# EAGLE schematic 8-STEP-SEQUENCER-1-1 (EAGLE 8.6.0)
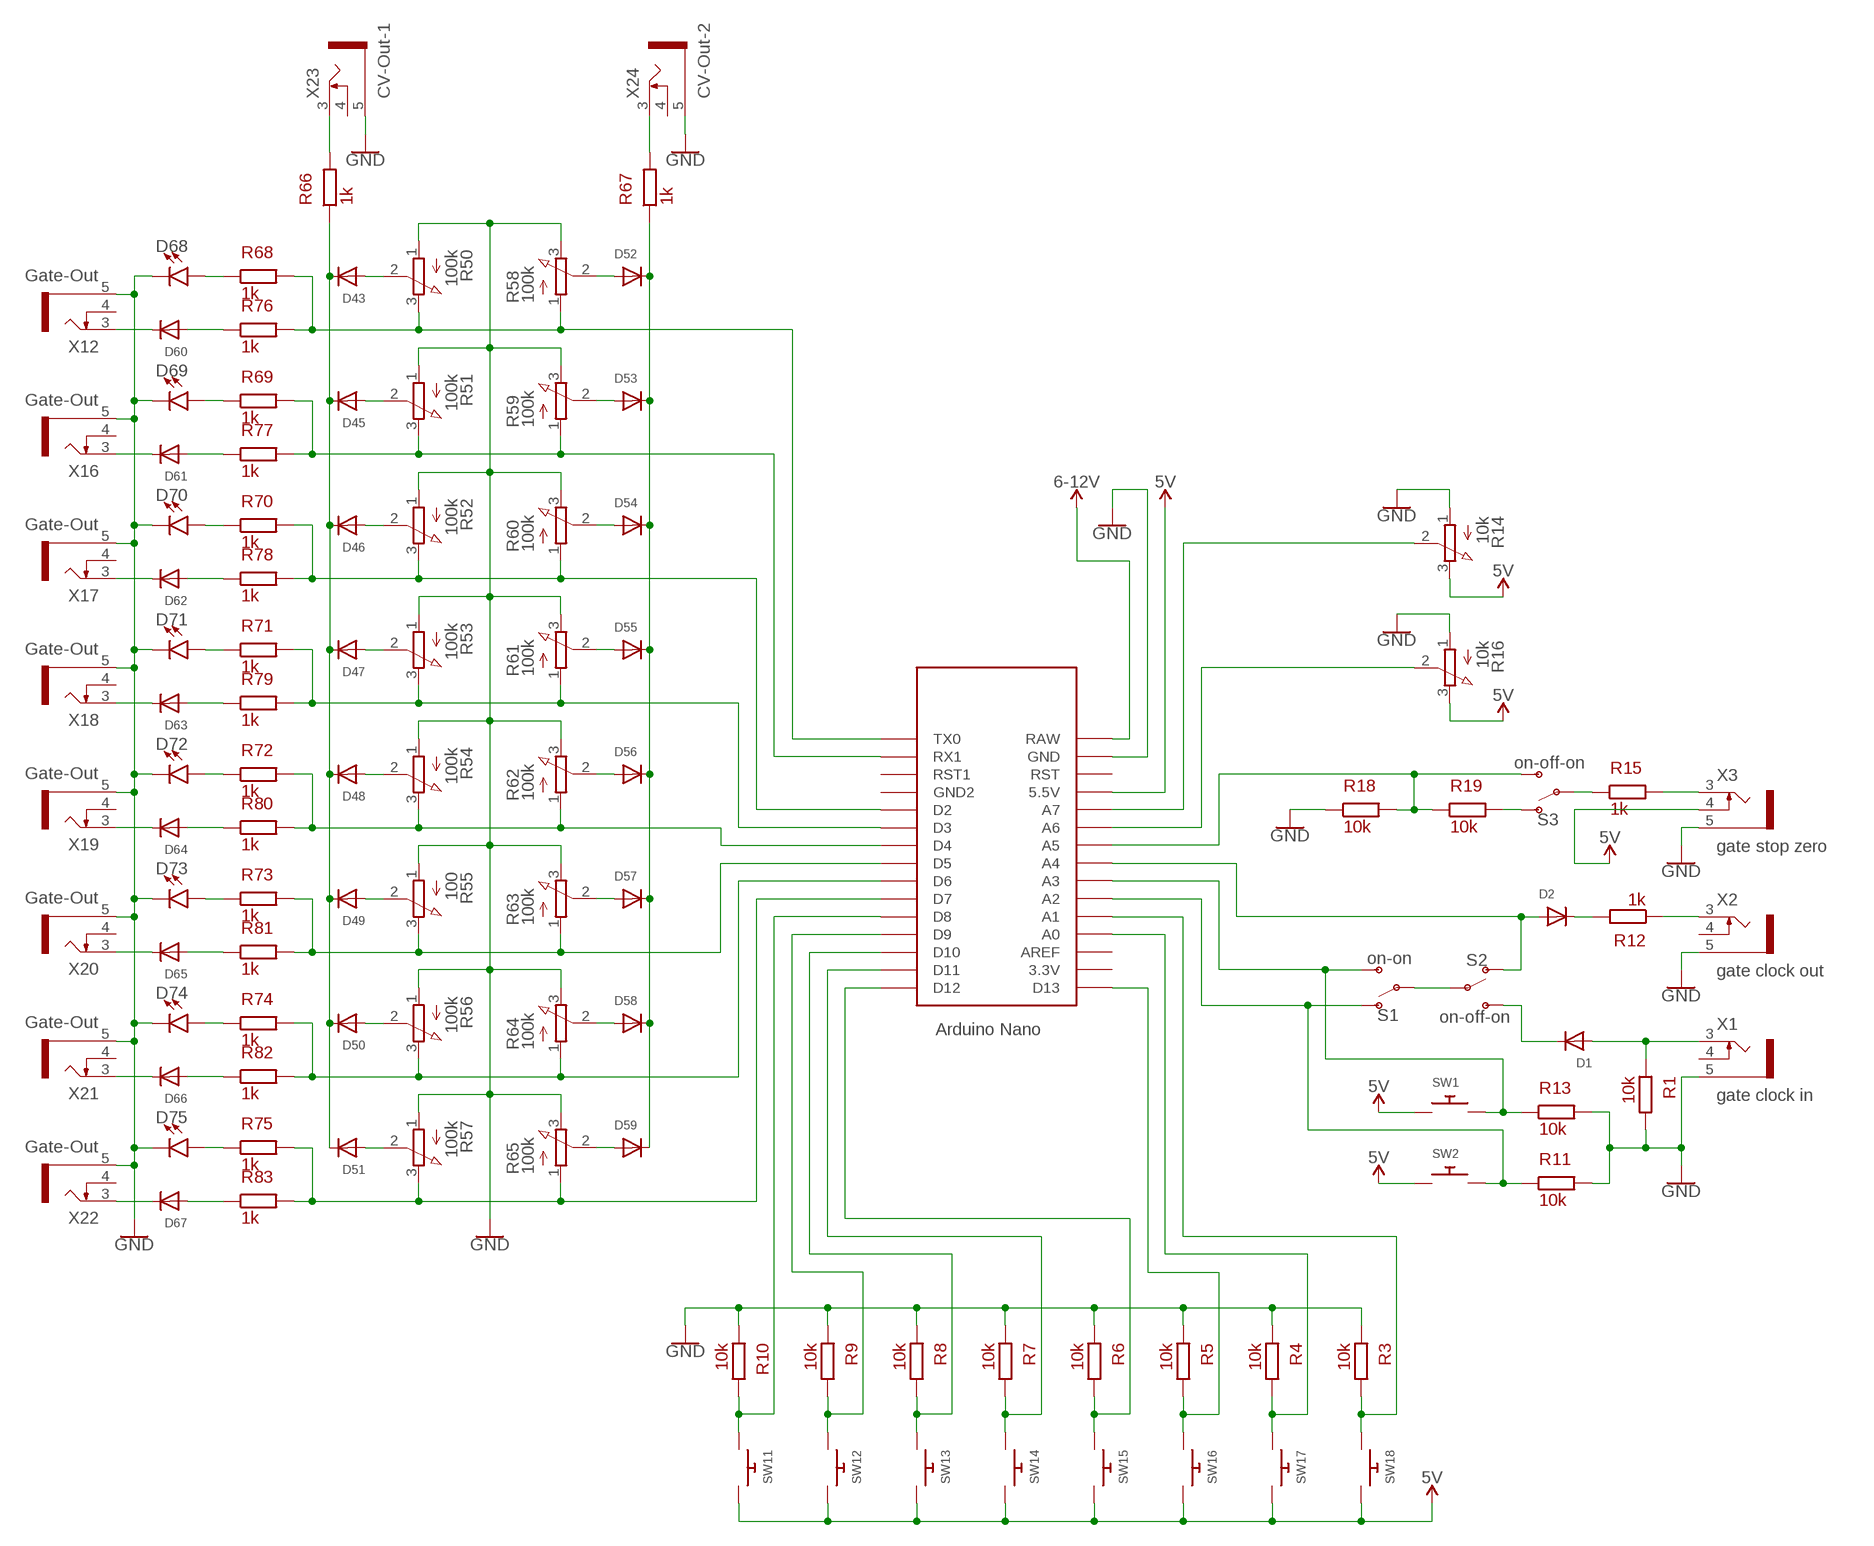
[diagram p0: schematic, sheet 1]

## Parts
D1  DIODEDO-1N4148  [DO-1N4148]
D2  DIODEDO-1N4148  [DO-1N4148]
D43  DIODEDO-1N4148  [DO-1N4148]
D45  DIODEDO-1N4148  [DO-1N4148]
D46  DIODEDO-1N4148  [DO-1N4148]
D47  DIODEDO-1N4148  [DO-1N4148]
D48  DIODEDO-1N4148  [DO-1N4148]
D49  DIODEDO-1N4148  [DO-1N4148]
D50  DIODEDO-1N4148  [DO-1N4148]
D51  DIODEDO-1N4148  [DO-1N4148]
D52  DIODEDO-1N4148  [DO-1N4148]
D53  DIODEDO-1N4148  [DO-1N4148]
D54  DIODEDO-1N4148  [DO-1N4148]
D55  DIODEDO-1N4148  [DO-1N4148]
D56  DIODEDO-1N4148  [DO-1N4148]
D57  DIODEDO-1N4148  [DO-1N4148]
D58  DIODEDO-1N4148  [DO-1N4148]
D59  DIODEDO-1N4148  [DO-1N4148]
D60  DIODEDO-1N4148  [DO-1N4148]
D61  DIODEDO-1N4148  [DO-1N4148]
D62  DIODEDO-1N4148  [DO-1N4148]
D63  DIODEDO-1N4148  [DO-1N4148]
D64  DIODEDO-1N4148  [DO-1N4148]
D65  DIODEDO-1N4148  [DO-1N4148]
D66  DIODEDO-1N4148  [DO-1N4148]
D67  DIODEDO-1N4148  [DO-1N4148]
D68  LED5MM  [LED_5MM]
D69  LED5MM  [LED_5MM]
D70  LED5MM  [LED_5MM]
D71  LED5MM  [LED_5MM]
D72  LED5MM  [LED_5MM]
D73  LED5MM  [LED_5MM]
D74  LED5MM  [LED_5MM]
D75  LED5MM  [LED_5MM]
R1  10k  R  (no package)
R3  10k  R  (no package)
R4  10k  R  (no package)
R5  10k  R  (no package)
R6  10k  R  (no package)
R7  10k  R  (no package)
R8  10k  R  (no package)
R9  10k  R  (no package)
R10  10k  R  (no package)
R11  10k  R  (no package)
R12  1k  R  (no package)
R13  10k  R  (no package)
R14  10k  3RP/1610N  [3RP/1610N]
R15  1k  R  (no package)
R16  10k  3RP/1610N  [3RP/1610N]
R18  10k  R  (no package)
R19  10k  R  (no package)
R50  100k  3RP/1610N  [3RP/1610N]
R51  100k  3RP/1610N  [3RP/1610N]
R52  100k  3RP/1610N  [3RP/1610N]
R53  100k  3RP/1610N  [3RP/1610N]
R54  100k  3RP/1610N  [3RP/1610N]
R55  100  3RP/1610N  [3RP/1610N]
R56  100k  3RP/1610N  [3RP/1610N]
R57  100k  3RP/1610N  [3RP/1610N]
R58  100k  3RP/1610N  [3RP/1610N]
R59  100k  3RP/1610N  [3RP/1610N]
R60  100k  3RP/1610N  [3RP/1610N]
R61  100k  3RP/1610N  [3RP/1610N]
R62  100k  3RP/1610N  [3RP/1610N]
R63  100k  3RP/1610N  [3RP/1610N]
R64  100k  3RP/1610N  [3RP/1610N]
R65  100k  3RP/1610N  [3RP/1610N]
R66  1k  R  (no package)
R67  1k  R  (no package)
R68  1k  R  (no package)
R69  1k  R  (no package)
R70  1k  R  (no package)
R71  1k  R  (no package)
R72  1k  R  (no package)
R73  1k  R  (no package)
R74  1k  R  (no package)
R75  1k  R  (no package)
R76  1k  R  (no package)
R77  1k  R  (no package)
R78  1k  R  (no package)
R79  1k  R  (no package)
R80  1k  R  (no package)
R81  1k  R  (no package)
R82  1k  R  (no package)
R83  1k  R  (no package)
S1  on-on  SWITCH-SPDT-PTH-11.6X4.0MM-KIT  [SWITCH_SPDT_PTH_11.6X4.0MM_KIT]
S2  on-off-on  SWITCH-SPDT-PTH-11.6X4.0MM-KIT  [SWITCH_SPDT_PTH_11.6X4.0MM_KIT]
S3  on-off-on  SWITCH-SPDT-PTH-11.6X4.0MM-KIT  [SWITCH_SPDT_PTH_11.6X4.0MM_KIT]
SW1  SWITCH_PUSHBUTTONSOFTTOUCHSMD_SJ  [PUSHBUTTON_SMD_SJ]
SW2  SWITCH_PUSHBUTTONSOFTTOUCHSMD_SJ  [PUSHBUTTON_SMD_SJ]
SW11  SWITCH_PUSHBUTTONSOFTTOUCHSMD_SJ  [PUSHBUTTON_SMD_SJ]
SW12  SWITCH_PUSHBUTTONSOFTTOUCHSMD_SJ  [PUSHBUTTON_SMD_SJ]
SW13  SWITCH_PUSHBUTTONSOFTTOUCHSMD_SJ  [PUSHBUTTON_SMD_SJ]
SW14  SWITCH_PUSHBUTTONSOFTTOUCHSMD_SJ  [PUSHBUTTON_SMD_SJ]
SW15  SWITCH_PUSHBUTTONSOFTTOUCHSMD_SJ  [PUSHBUTTON_SMD_SJ]
SW16  SWITCH_PUSHBUTTONSOFTTOUCHSMD_SJ  [PUSHBUTTON_SMD_SJ]
SW17  SWITCH_PUSHBUTTONSOFTTOUCHSMD_SJ  [PUSHBUTTON_SMD_SJ]
SW18  SWITCH_PUSHBUTTONSOFTTOUCHSMD_SJ  [PUSHBUTTON_SMD_SJ]
U$1  NANO  [NANO]
X1  gate clock in  KLBR1  [KLBR1]
X2  gate clock out  KLBR1  [KLBR1]
X3  gate stop zero  KLBR1  [KLBR1]
X12  Gate-Out  KLBR1  [KLBR1]
X16  Gate-Out  KLBR1  [KLBR1]
X17  Gate-Out  KLBR1  [KLBR1]
X18  Gate-Out  KLBR1  [KLBR1]
X19  Gate-Out  KLBR1  [KLBR1]
X20  Gate-Out  KLBR1  [KLBR1]
X21  Gate-Out  KLBR1  [KLBR1]
X22  Gate-Out  KLBR1  [KLBR1]
X23  CV-Out-1  KLBR1  [KLBR1]
X24  CV-Out-2  KLBR1  [KLBR1]

## Nets
5V: R14.3(E) R16.3(E) SW1.P$1 SW2.P$1 SW11.P$2 SW12.P$2 SW13.P$2 SW14.P$2 SW15.P$2 SW16.P$2 SW17.P$2 SW18.P$2 U$1.5V(5.5V) U$1.RAW X3.4 ; supply symbol labelled 6-12V
GND: D68.K(C) D69.K(C) D70.K(C) D71.K(C) D72.K(C) D73.K(C) D74.K(C) D75.K(C) R1.2 R3.1 R4.1 R5.1 R6.1 R7.1 R8.1 R9.1 R10.1 R11.2 R13.2 R14.1(A) R16.1(A) R18.1 R50.1(A) R51.1(A) R52.1(A) R53.1(A) R54.1(A) R55.1(A) R56.1(A) R57.1(A) R58.3(E) R59.3(E) R60.3(E) R61.3(E) R62.3(E) R63.3(E) R64.3(E) R65.3(E) U$1.GND X1.5 X2.5 X3.5 X12.5 X16.5 X17.5 X18.5 X19.5 X20.5 X21.5 X22.5 X23.5 X24.5
N$2: R56.3(E) R64.1(A) R74.2 R82.2
N$3: R5.2 SW16.P$1 U$1.D13
N$4: R57.3(E) R65.1(A) R75.2 R83.2
N$5: R8.2 SW13.P$1 U$1.D10
N$6: R9.2 SW12.P$1 U$1.D9
N$7: R7.2 SW14.P$1 U$1.D11
N$8: R54.3(E) R62.1(A) R72.2 R80.2
N$9: R3.2 SW18.P$1 U$1.A1
N$11: R6.2 SW15.P$1 U$1.D12
N$12: R10.2 SW11.P$1 U$1.D8
N$13: R4.2 SW17.P$1 U$1.A0
N$14: D1.C S2.3(S)
N$15: D1.A R1.1 X1.3
N$16: R13.1 S1.3(S) SW1.P$2 U$1.A3
N$17: D2.C R12.2
N$18: D2.A S2.1(O) U$1.A4
N$19: S1.2(P) S2.2(P)
N$20: R11.1 S1.1(O) SW2.P$2 U$1.A2
N$21: R16.2(S) U$1.A6
N$23: R12.1 X2.3
N$25: R15.1 S3.2(P)
N$26: R15.2 X3.3
N$27: R18.2 R19.1 S3.3(S) U$1.A5
N$28: R19.2 S3.1(O)
N$34: D43.A R50.2(S)
N$56: D45.A R51.2(S)
N$57: D46.A R52.2(S)
N$59: D47.A R53.2(S)
N$60: D48.A R54.2(S)
N$62: D49.A R55.2(S)
N$64: R14.2(S) U$1.A7
N$65: D50.A R56.2(S)
N$66: D51.A R57.2(S)
N$70: D52.A R58.2(S)
N$76: D53.A R59.2(S)
N$78: D54.A R60.2(S)
N$80: D55.A R61.2(S)
N$82: D56.A R62.2(S)
N$87: D57.A R63.2(S)
N$88: D58.A R64.2(S)
N$91: D59.A R65.2(S)
N$92: D43.C D45.C D46.C D47.C D48.C D49.C D50.C D51.C R66.1
N$93: D52.C D53.C D54.C D55.C D56.C D57.C D58.C D59.C R67.1
N$94: R66.2 X23.3
N$95: R67.2 X24.3
N$96: D62.C X17.3
N$97: D61.C X16.3
N$98: D60.C X12.3
N$99: D68.A R68.1
N$100: D69.A R69.1
N$101: D70.A R70.1
N$102: D71.A R71.1
N$103: D72.A R72.1
N$104: D73.A R73.1
N$105: D74.A R74.1
N$106: D75.A R75.1
N$107: D60.A R76.1
N$108: D61.A R77.1
N$109: D62.A R78.1
N$110: D63.A R79.1
N$111: D64.A R80.1
N$112: D65.A R81.1
N$113: D67.C X22.3
N$114: D67.A R83.1
N$115: D66.A R82.1
N$116: D66.C X21.3
N$117: D65.C X20.3
N$118: D63.C X18.3
N$119: D64.C X19.3
N$120: R50.3(E) R58.1(A) R68.2 R76.2 U$1.TX0
N$121: R51.3(E) R59.1(A) R69.2 R77.2 U$1.RX1
N$122: R52.3(E) R60.1(A) R70.2 R78.2
N$123: R53.3(E) R61.1(A) R71.2 R79.2
N$124: R55.3(E) R63.1(A) R73.2 R81.2
Unconnected: U$1.3.3V U$1.AREF U$1.D2 U$1.D3 U$1.D4 U$1.D5 U$1.D6 U$1.D7 U$1.GND1(GND2) U$1.ICSP1 U$1.ICSP2 U$1.ICSP3 U$1.ICSP4 U$1.ICSP5 U$1.ICSP6 U$1.RST U$1.RST1 X1.4 X2.4 X12.4 X16.4 X17.4 X18.4 X19.4 X20.4 X21.4 X22.4 X23.4 X24.4

## Library data of the parts
D1 D2 D43 D45-D67 = adafruit:DIODE: Diode SMADIODE - SMA Surface Mount Package 20V 1A Schottky Diode Digikey: 641-1014-6-ND DO-1N4148 - Through Hole Small Current Diode SOD-123 20V 1 A (.5mV Vf) Schottky Diode - Digikey: MBRX120TPMSCT-ND SOD-323 10V 570mA (.38mV Vf, 3ns) Schottky Diode - Digikey: ZLLS410CT-ND SOD-523 30V 30mA Schottky Diode (RB751S-40TE61) - Digikey: RB751S-40TE61CT-ND SOT23-R/W - SOT23 Package (R = Solder Paste/Reflow Ovens, W = Hand-Soldering) BAT54Film 40V 300mA - Digikey: 497-7162-1-ND
D68-D75 = SparkFun-LED:LED: LED (Generic) Standard schematic elements and footprints for 5mm, 3mm, 1206, and 0603 sized LEDs. Generic LEDs with no color specified.
R1 R3-R13 R15 R18 R19 R66-R83 = ngspice-simulation:R: RESISTOR
R14 R16 R50-R65 = pot:3RP/1610N: 16mm Potentiometer one level Source: http://www.alphapotentiometers.net/html/16mm_pot_2.html
S1-S3 = SparkFun-Switches:SWITCH-SPDT: Single Pole, Double Throw (SPDT) Switch Single-pole, double-throw (SPDT) switch. Variant Overview SMD-AYZ0202 Surface Mount DPDT Switch <https://www.sparkfun.com/products/597> (COM-00597) Used on e.g. LilyPad Arduino USB - ATmega32U4 Board <https://www.sparkfun.com/products/12049> PTH-11.6X4.0MM SPDT Mini Power Switch <https://www.sparkfun.com/products/102> (COM-00102) Used on e.g. SparkFun Simon Says - Through-Hole Soldering Kit <https://www.sparkfun.com/products/10547> (KIT-10547) PTH-11.6X4.0MM-KIT KIT version of SPDT Mini Power Switch - Simplifies soldering by removing tStop of switch pins - only one side can be soldered. PTH-11.6X4.0MM-LOCK LOCK version of SPDT Mini Power Switch - Offset pins hold switch in place for easier soldering. SMD-RIGHT-ANGLE Surface Mount Right Angle Switch <https://www.sparkfun.com/products/10860> (COM-10860) Used on e.g. SparkFun ESP8266 Thing <https://www.sparkfun.com/products/13231>; PROD_ID: SWCH-08261; SF_SKU: COM-00102
SW1 SW2 SW11-SW18 = adafruit:SWITCH_PUSHBUTTON: Buttons SOFTTOUCHSMD_SJ - Soft touch temporary push button (Super Junk Akihabara) Compatible with SKPMANE010 [Mouser: 688-SKPMAN] C&K_KSS = Digikey: KSS221GLFS
U$1 = Arduino-clone:NANO: Arduino Nano
X1-X3 X12 X16-X24 = con-lumberg:KLBR?: Jack connectors according to JISC 6560, 2.5mm / 3.5 mm Klinkensteckverbinder nach JISC 6560, 2.5mm / 3,5 mm Source: http://www.lumberg.com/Produkte/PDFs/KLBR2.pdf www.lumberg.com/Produkte/PDFs/KLBR1.pdf; MPN: KLBR 1; OC_FARNELL: 1200140; OC_NEWARK: 97K2707